# Altium schematic sheet MOD_SONIDO.SchDoc
size A4
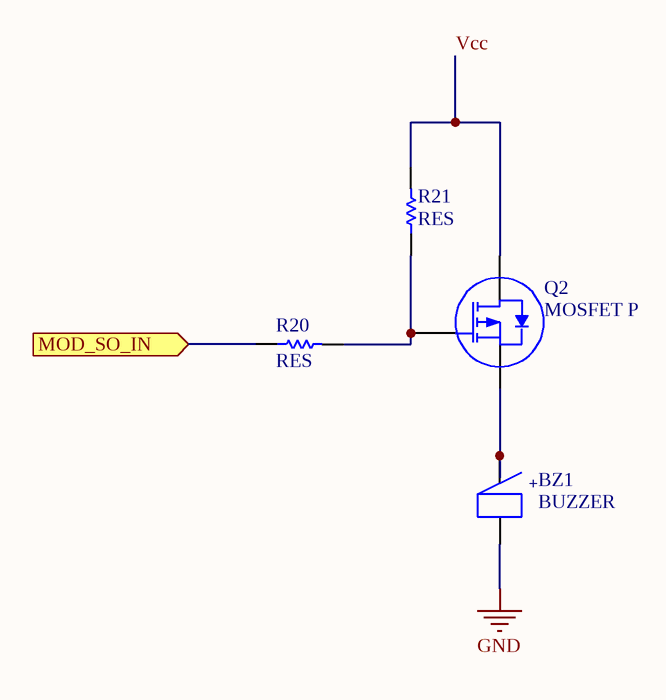
[diagram p0: MOD_SONIDO.SchDoc]

## Parts
BZ1  BUZZER  [BUZZER 12MM]
Q2  MOSFET P  [SOT23]
R20  RES  [0805]
R21  RES  [0805]

## Ports
MOD_SO_IN (in)

## Nets
GND: BZ1.2
MOD_SO_IN: R20.1 ; port MOD_SO_IN
Vcc: Q2.2(D) R21.2
NetBZ1_1: BZ1.1 Q2.3(S)
NetQ2_1: Q2.1(G) R20.2 R21.1

## Notes on the sheet
- (in symbol BUZZER) +